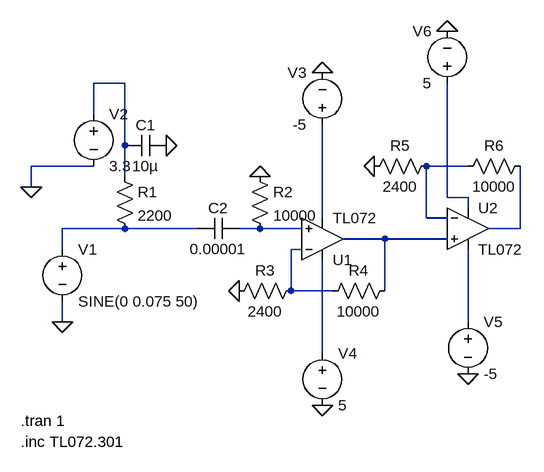
[diagram p0: schematic input.asc]
input.asc, the LTspice schematic file:
Version 4.1
SHEET 1 880 680
WIRE 160 -128 112 -128
WIRE 112 -80 112 -128
WIRE 160 -32 160 -128
WIRE 112 0 16 0
WIRE 688 0 624 0
WIRE 160 16 160 -32
WIRE 16 32 16 0
WIRE 656 48 656 -128
WIRE 688 48 656 48
WIRE 688 64 688 48
WIRE 464 80 464 -64
WIRE 624 80 624 0
WIRE 656 80 624 80
WIRE 160 96 64 96
WIRE 272 96 160 96
WIRE 368 96 336 96
WIRE 432 96 368 96
WIRE 768 96 768 0
WIRE 768 96 720 96
WIRE 560 112 496 112
WIRE 656 112 560 112
WIRE 64 128 64 96
WIRE 432 128 416 128
WIRE 416 192 416 128
WIRE 480 192 416 192
WIRE 560 192 560 112
WIRE 64 240 64 208
WIRE 688 240 688 128
WIRE 464 288 464 144
FLAG 64 240 0
FLAG 16 32 0
FLAG 224 -32 0
FLAG 368 16 0
FLAG 336 192 0
FLAG 544 0 0
FLAG 464 -144 0
FLAG 464 368 0
FLAG 688 320 0
FLAG 656 -208 0
SYMBOL voltage 64 112 R0
WINDOW 123 0 0 Left 0
WINDOW 39 0 0 Left 0
SYMATTR InstName V1
SYMATTR Value SINE(0 0.075 50)
SYMBOL res 144 0 R0
SYMATTR InstName R1
SYMATTR Value 2200
SYMBOL voltage 112 -96 R0
WINDOW 123 0 0 Left 0
WINDOW 39 0 0 Left 0
SYMATTR InstName V2
SYMATTR Value 3.3
SYMBOL cap 160 -16 R270
WINDOW 0 32 32 VTop 2
WINDOW 3 0 32 VBottom 2
SYMATTR InstName C1
SYMATTR Value 10µ
SYMATTR Description Capacitor
SYMATTR Type cap
SYMATTR SpiceLine V=6.3 Irms=15m Rser=2.8021 Lser=879p mfg="Würth Elektronik" pn="865250140001 WCAP-ASNP 4x5,5" type="Al electrolytic"
SYMBOL cap 272 112 R270
WINDOW 0 32 32 VTop 2
WINDOW 3 0 32 VBottom 2
SYMATTR InstName C2
SYMATTR Value 0.00001
SYMBOL OpAmps\\opamp2 464 176 M180
SYMATTR InstName U1
SYMATTR Value TL072
SYMBOL res 352 0 R0
SYMATTR InstName R2
SYMATTR Value 10000
SYMBOL res 432 176 R90
WINDOW 0 0 56 VBottom 2
WINDOW 3 32 56 VTop 2
SYMATTR InstName R3
SYMATTR Value 2400
SYMBOL res 576 176 R90
WINDOW 0 0 56 VBottom 2
WINDOW 3 32 56 VTop 2
SYMATTR InstName R4
SYMATTR Value 10000
SYMBOL OpAmps\\opamp2 688 32 R0
SYMATTR InstName U2
SYMATTR Value TL072
SYMBOL res 640 -16 R90
WINDOW 0 0 56 VBottom 2
WINDOW 3 32 56 VTop 2
SYMATTR InstName R5
SYMATTR Value 2400
SYMBOL res 784 -16 R90
WINDOW 0 0 56 VBottom 2
WINDOW 3 32 56 VTop 2
SYMATTR InstName R6
SYMATTR Value 10000
SYMBOL voltage 464 -48 R180
WINDOW 0 24 96 Left 2
WINDOW 3 24 16 Left 2
WINDOW 123 0 0 Left 0
WINDOW 39 0 0 Left 0
SYMATTR InstName V3
SYMATTR Value -5
SYMBOL voltage 464 272 R0
WINDOW 123 0 0 Left 0
WINDOW 39 0 0 Left 0
SYMATTR InstName V4
SYMATTR Value 5
SYMBOL voltage 688 224 R0
WINDOW 123 0 0 Left 0
WINDOW 39 0 0 Left 0
SYMATTR InstName V5
SYMATTR Value -5
SYMBOL voltage 656 -112 R180
WINDOW 0 24 96 Left 2
WINDOW 3 24 16 Left 2
WINDOW 123 0 0 Left 0
WINDOW 39 0 0 Left 0
SYMATTR InstName V6
SYMATTR Value 5
TEXT 0 392 Left 2 !.tran 1
TEXT 0 424 Left 2 !.inc TL072.301

The netlist it stands for:
* input.asc
V1 N005 0 SINE(0 0.075 50)
R1 N001 N005 2200
V2 N001 0 3.3
C1 N001 0 10µ V=6.3 Irms=15m Rser=2.8021 Lser=879p mfg="Würth Elektronik" pn="865250140001 WCAP-ASNP 4x5,5" type="Al electrolytic"
C2 N005 N006 0.00001
X§U1 N006 N009 N011 N004 N008 TL072  ; pins In+ In- V+ V- OUT
R2 0 N006 10000
R3 N009 0 2400
R4 N008 N009 10000
X§U2 N008 N002 N003 N010 N007 TL072  ; pins In+ In- V+ V- OUT
R5 N002 0 2400
R6 N007 N002 10000
V3 N004 0 -5
V4 N011 0 5
V5 N010 0 -5
V6 N003 0 5
.tran 1
.inc TL072.301
.backanno
.end